# EAGLE design rapidshark-flywheel-driver-mk-2.0 (EAGLE 6.5.0)
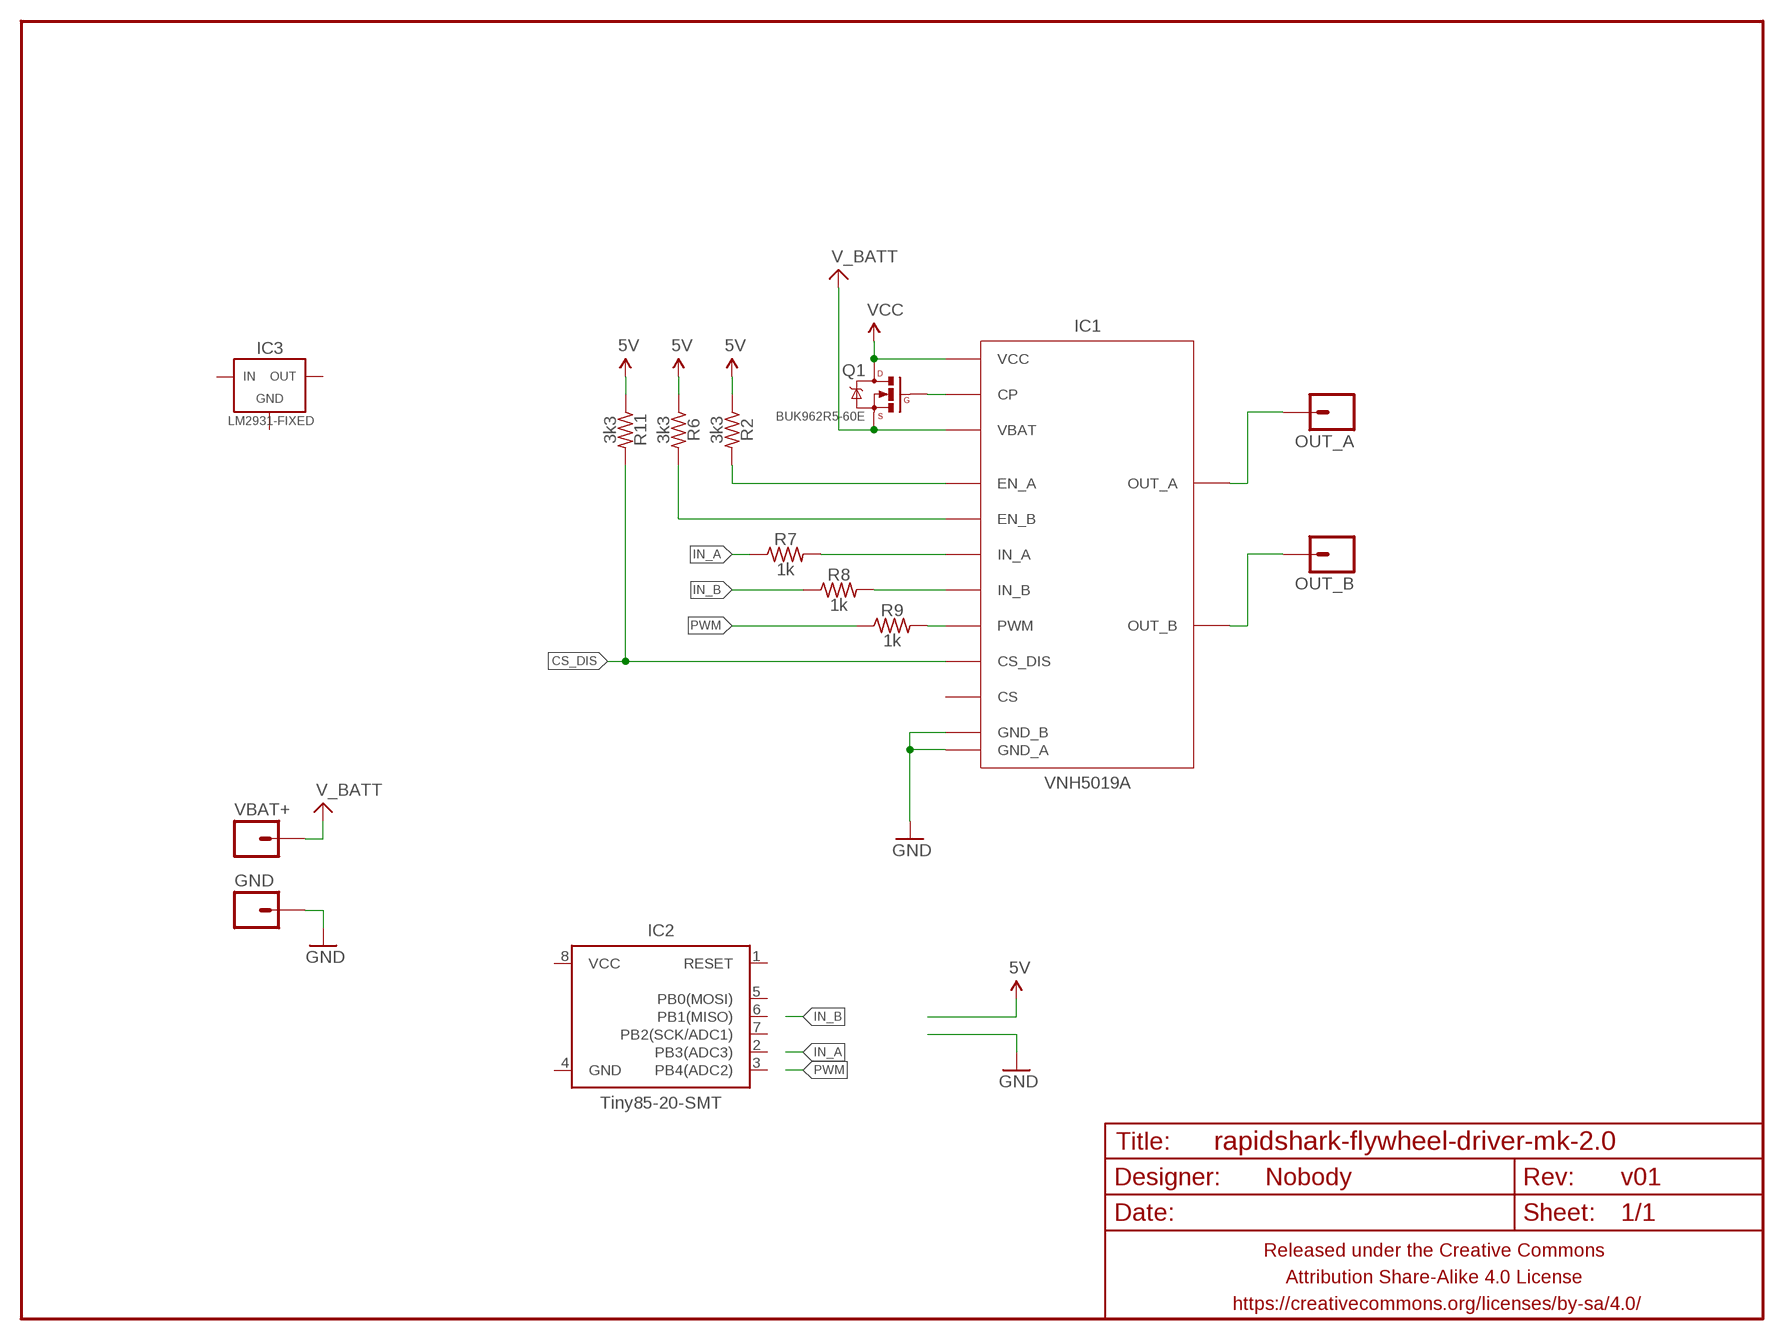
[diagram p0: schematic, sheet 1]

## Parts
FRAME1  FRAME-LETTERNO_PACKAGE  [DUMMY]
GND  M0112AWG  [1X01-12AWG]
IC1  VNH5019A  [VNH5019A]
IC2  Tiny85-20-SMT  ATTINY45TINY85-20-SOICW  [SO08-EIAJ]
IC3  LM2931-FIXED  [SO08]
OUT_A  M0112AWG  [1X01-12AWG]
OUT_B  M0112AWG  [1X01-12AWG]
Q1  BUK962R5-60E  MOSFET-NCHANNELFDD8780  [DPAK]
R2  3k3  RESISTORR0603  [R0603]
R6  3k3  RESISTORR0603  [R0603]
R7  1k  RESISTORR0603  [R0603]
R8  1k  RESISTORR0603  [R0603]
R9  1k  RESISTORR0603  [R0603]
R11  3k3  RESISTORR0603  [R0603]
VBAT+  M0112AWG  [1X01-12AWG]

## Nets
5V: R2.1 R6.1 R11.1
CS_DIS: IC1.6(CS_DIS) R11.2
EN_A1: IC1.5(EN_A) R2.2
EN_B1: IC1.9(EN_B) R6.2
GATE: IC1.11(CP) Q1.1(G)
GND: GND.1 IC1.17(GND_A) IC1.18(GND_B) IC1.19(GND_B) IC1.20(GND_B) IC1.26(GND_A) IC1.27(GND_A) IC1.28(GND_A) IC1.29(GND_A)
IN_A: R7.1
IN_A1: IC1.4(IN_A) R7.2
IN_B: R8.1
IN_B1: IC1.10(IN_B) R8.2
OUT_A: IC1.1(OUT_A) IC1.24(OUT_A) IC1.25(OUT_A) IC1.30(OUT_A) IC1.HS2(OUT_A) OUT_A.1
OUT_B: IC1.15(OUT_B) IC1.16(OUT_B) IC1.21(OUT_B) IC1.22(OUT_B) IC1.HS3(OUT_B) OUT_B.1
PWM: R9.1
PWM1: IC1.7(PWM) R9.2
V_BATT: IC1.12(VBAT) Q1.3(S) VBAT+.1
VCC: IC1.2(VCC) IC1.3(VCC) IC1.13(VCC) IC1.14(VCC) IC1.23(VCC) IC1.HS1(VCC) Q1.4(D)
Unconnected: IC1.8(CS) IC2.1(RESET) IC2.2(PB3(ADC3)) IC2.3(PB4(ADC2)) IC2.4(GND) IC2.5(PB0(MOSI)) IC2.6(PB1(MISO)) IC2.7(PB2(SCK/ADC1)) IC2.8(VCC) IC3.1(OUT) IC3.2(GND) IC3.3(GND) IC3.4(GND) IC3.5(GND) IC3.6(GND) IC3.7(GND) IC3.8(IN)

## Library data of the parts
FRAME1 = A_butts:FRAME-LETTER: Schematic Frame Standard 8.5x11 US Letter frame; DESIGNER: Nobody; VERSION: v01
GND OUT_A OUT_B VBAT+ = A_butts:M01: Header 1 Standard 1-pin 0.1" header. Use with straight break away headers (SKU : PRT-00116), right angle break away headers (PRT-00553), swiss pins (PRT-00743), machine pins (PRT-00117), and female headers (PRT-00115).
IC1 = A_butts:VNH5019A
IC2 = A_butts:ATTINY45: Atmel 8-pin 2/4/8kB flash uC; PROD_ID: IC-09092
IC3 = A_butts:LM2931-FIXED
Q1 = A_butts:MOSFET-NCHANNEL: Common NMOSFET Parts MFG P/N Store ID Prod ID FDD8780 TRANS-09984 SI7820DN TRANS-11055 FDS6630A IC-08089 2N7002PW TRANS-11151 FQP30N06L COM-10213 TRANS-10060 BSS123LT1G TRANS-08345 BSS138 TRANS-00830 BS170 2N7000; PROD_ID: TRANS-09984
R2 R6-R9 R11 = A_butts:RESISTOR: RESISTOR, American symbol

## Board
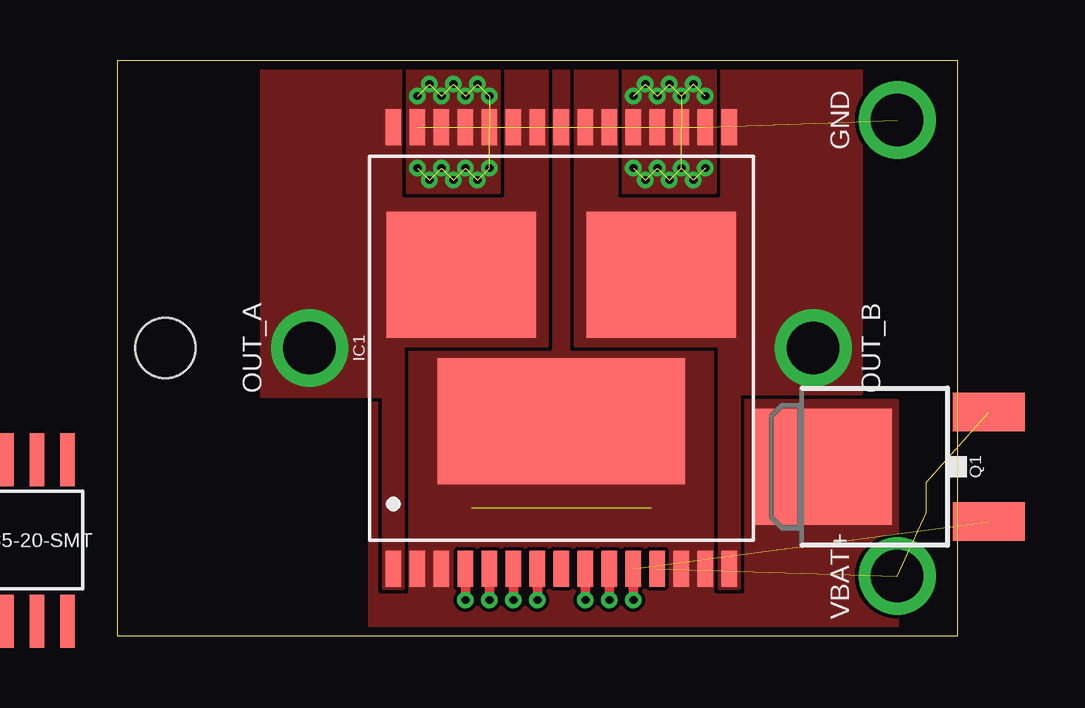
[diagram p1: board, top side]
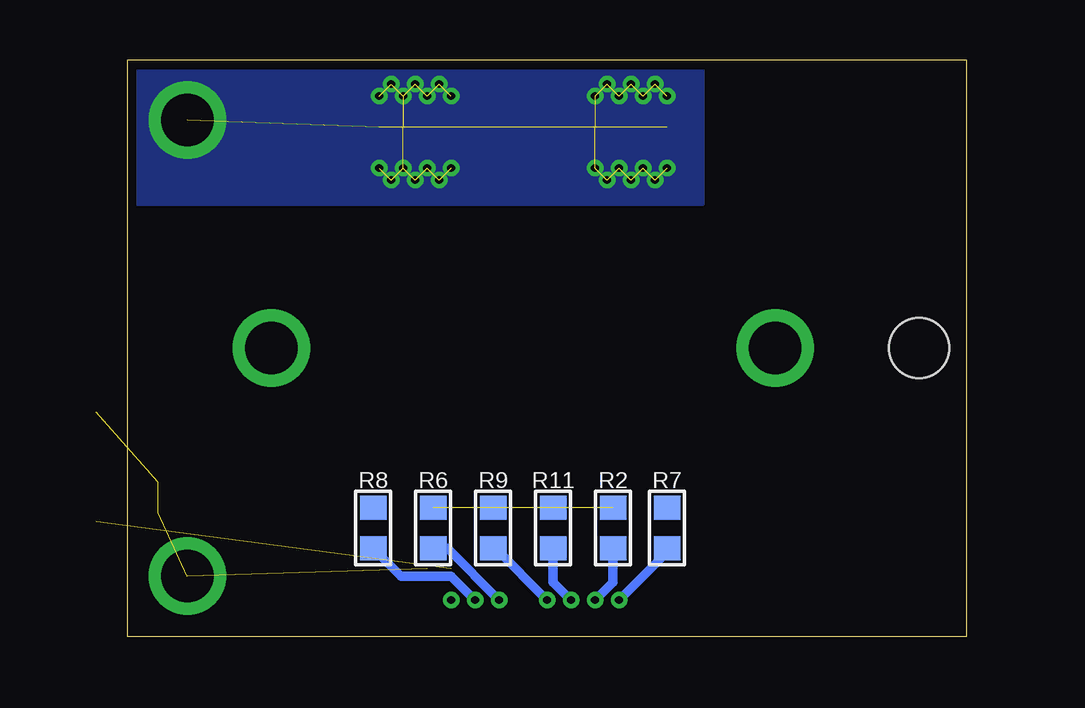
[diagram p2: board, bottom side, seen from below]

Size 35 x 24 mm. Coordinates in mm from the lower left corner, seen from the top.
Outline: 35,24 35,0 0,0 0,24 35,24
Copper layers (1*16): Top 0.0356mm / dielectric 1.5011mm / Bottom 0.0356mm
Design rules "LaenPCBOrder_2": minimum track width 6mil, minimum drill 13mil, track to track 6mil, track to pad 6mil, pad to pad 6mil, via to via 6mil, smd to smd 6mil, copper to edge 15mil, drill to drill 6mil, minimum pad ring 7mil, minimum via ring 7mil, stop-mask expansion 3mil, vias tented up to drill 20mil, thermal gap 10mil
Holes 2.5 mm at 2,12

### Footprints (pad centres in the part's own frame; a part is rotated, then mirrored left to right if it is on the bottom)
1X01-12AWG = drill 2.2 pad 3.2: 1 0,0
VNH5019A = smd 1.5 x 0.65: 1 -9.2,7; 2 -9.2,6; 3 -9.2,5; 4 -9.2,4; 5 -9.2,3; 6 -9.2,2; 7 -9.2,1; 8 -9.2,0; 9 -9.2,-1; 10 -9.2,-2; 11 -9.2,-3; 12 -9.2,-4; 13 -9.2,-5; 14 -9.2,-6; 15 -9.2,-7; 16 9.2,-7; 17 9.2,-6; 18 9.2,-5; 19 9.2,-4; 20 9.2,-3; 21 9.2,-2; 22 9.2,-1; 23 9.2,0; 24 9.2,1; 25 9.2,2; 26 9.2,3; 27 9.2,4; 28 9.2,5; 29 9.2,6; 30 9.2,7 | smd 5.25 x 10.3: HS1 -3.05,0 | smd 5.25 x 6.23: HS2 3.05,4.165; HS3 3.05,-4.165
SO08-EIAJ = smd 0.61 x 2.21: 1 -1.905,-3.378; 2 -0.635,-3.378; 3 0.635,-3.378; 4 1.905,-3.378; 5 1.905,3.353; 6 0.635,3.353; 7 -0.635,3.353; 8 -1.905,3.353
SO08 = smd 0.61 x 2.21: 1 -1.905,-2.616; 2 -0.635,-2.616; 3 0.635,-2.616; 4 1.905,-2.616; 5 1.905,2.616; 6 0.635,2.616; 7 -0.635,2.616; 8 -1.905,2.616
DPAK = smd 1.6 x 3: 1 -2.28,-5.31; 3 2.28,-5.31 | smd 4.826 x 5.715: 4 0,1.588
R0603 = smd 1 x 1.1: 1 -0.85,0; 2 0.85,0

### Placement (x,y rotation side)
FRAME1  0,0 0 bottom
GND  32.5,21.5 90 top
IC1  18.5,12 90 top
IC2  -4,4 0 top
IC3  -10.5,3 0 top  (outside the outline)
OUT_A  8,12 90 top
OUT_B  29,12 270 top
Q1  31,7.05 90 top
R2  14.75,4.5 270 bottom
R6  22.25,4.5 270 bottom
R7  12.5,4.5 270 bottom
R8  24.75,4.5 270 bottom
R9  19.75,4.5 270 bottom
R11  17.25,4.5 270 bottom
VBAT+  32.5,2.5 90 top

### Tracks (layer width: path | path; a pad name or v marks a point on that pad's centre or on a via)
5V  (2 unrouted)
CS_DIS  (via drill 0.33)
  Top 0.4: IC1.6 v16.5,1.5
  Bottom 0.4: R11.2 17.25,2.25 v16.5,1.5
EN_A1  (via drill 0.33)
  Top 0.4: IC1.5 v15.5,1.5
  Bottom 0.4: R2.2 14.75,2.25 v15.5,1.5
EN_B1  (via drill 0.33)
  Top 0.4: IC1.9 v19.5,1.5
  Bottom 0.4: R6.2 21.65,3.65 v19.5,1.5
GATE  (via drill 0.33)  (1 unrouted)
  Top 0.4: IC1.11 v21.5,1.5
GND  (via drill 0.33)  (36 unrouted)
  other vias: 13.5,19.5 14.5,19.5 15.5,19.5 12.5,19.5 13.5,22.5 14.5,22.5 15.5,22.5 12.5,22.5 13,23 14,23 15,23 13,19 14,19 15,19 22.5,22.5 23.5,22.5 24.5,22.5 21.5,22.5 22,23 23,23 24,23 22.5,19.5 23.5,19.5 24.5,19.5 21.5,19.5 22,19 23,19 24,19
  pour Top (rank 3, no thermals): 12.1,24 12.1,18.5 15.9,18.5 15.9,24
  pour Bottom (rank 6, no thermals): 11,24 11,18 35,18 35,24
  pour Top (rank 4, no thermals): 21.1,24 21.1,18.5 24.9,18.5 24.9,24
IN_A1  (via drill 0.33)
  Top 0.4: IC1.4 v14.5,1.5
  Bottom 0.4: R7.2 12.5,3.5 v14.5,1.5
IN_B1  (via drill 0.33)
  Top 0.4: IC1.10 v20.5,1.5
  Bottom 0.4: R8.2 23.6,2.5 21.5,2.5 v20.5,1.5
OUT_A
  pour Top (rank 5, no thermals): 6,23.75 6,10 11.1,10 11.1,2 11.9,2 11.9,12.1 17.9,12.1 17.9,24
OUT_B
  pour Top (rank 5, no thermals): 19.1,24 19.1,12.1 25.1,12.1 25.1,2 25.9,2 25.9,10.1 31,10.1 31,24
PWM1  (via drill 0.33)
  Top 0.4: IC1.7 v17.5,1.5
  Bottom 0.4: R9.2 19.65,3.65 v17.5,1.5
V_BATT  (4 unrouted)
VCC
  pour Top (rank 6, no thermals): 10.5,0 32.5,0 32.5,9.8 26.5,9.8 26.5,24 10.5,24